# Altium schematic sheet Laderegler NiMh.SchDoc
size A3; ApprovedBy: SI; CheckedBy: SI; Author: SI; CompanyName: KundenName; DrawnBy: SI; Engineer: SI; Organization: Sven Ingelfinger IT-Trainer; Address1: Ruländerstraße 5; Address2: 74235; Address3: Erlenbach; SheetNumber: 5; SheetTotal: 7; OrganizationDescription: Altium Trainer & Consultant
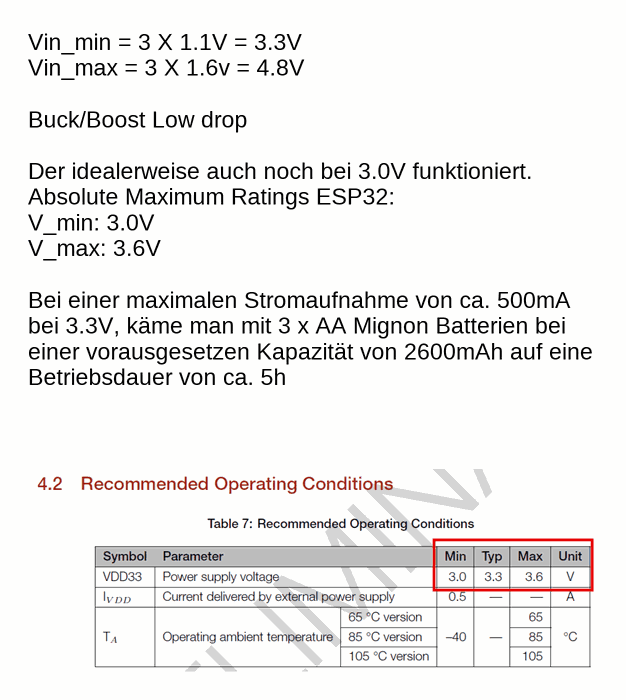
[diagram p0: Laderegler NiMh.SchDoc]

## Notes on the sheet
- Vin_min = 3 X 1.1V = 3.3V
  Vin_max = 3 X 1.6v = 4.8V
  Buck/Boost Low drop
  Der idealerweise auch noch bei 3.0V funktioniert.
  Absolute Maximum Ratings ESP32:
  V_min: 3.0V
  V_max: 3.6V
  Bei einer maximalen Stromaufnahme von ca. 500mA bei 3.3V, käme man mit 3 x AA Mignon Batterien bei einer vorausgesetzen Kapazität von 2600mAh auf eine Betriebsdauer von ca. 5h
- Project
- Schematic Sheet
- EDATRON Solutions GmbH
- Engineering | Training | Consulting
- www.edatron-solutions.com <http://www.edatron-solutions.com>
- Assembly Variant
- Drawn
- Date
- Checked
- Approved
- Project Number
- Customer
- Version/ Revisionindex
- Sheet
- /
- Contact Person
- Name:
- E-Mail:
- Phone: